# Altium schematic sheet Ext_Mem.SchDoc
size B; Organization: Altium Limited; Address1: L3, 12a Rodborough Rd; Address2: Frenchs Forest; Address3: NSW; Address4: Australia 2086; DocumentNumber: 2; SheetNumber: 2; SheetTotal: 2
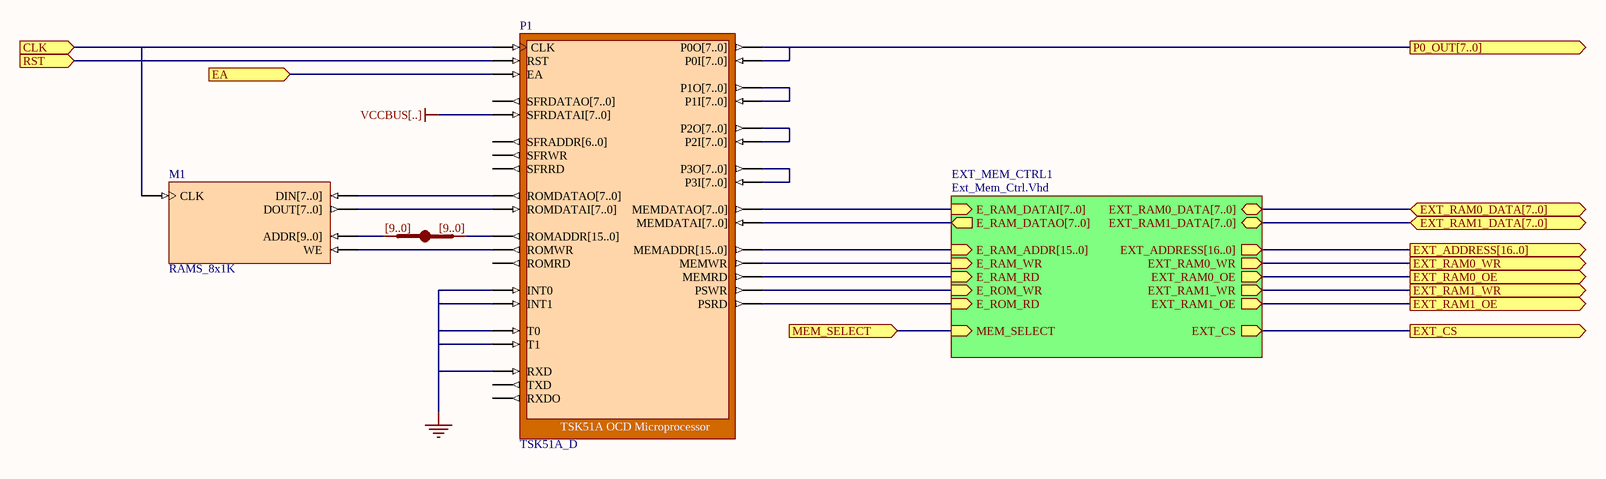
[diagram p0: Ext_Mem.SchDoc]

## Parts
M1  RAMS_8x1K
P1  TSK51A_D
U1  IndexA: [9..0]  (hidden comment: JB)

## Sub-sheets
EXT_MEM_CTRL1 = Ext_Mem_Ctrl.Vhd: EXT_CS (out), E_RAM_ADDR[15..0] (in), E_RAM_DATAI[7..0] (in), E_RAM_DATAO[7..0] (out), E_RAM_RD (in), E_RAM_WR (in), EXT_ADDRESS[16..0] (out), MEM_SELECT (in), EXT_RAM0_DATA[7..0] (bidir), EXT_RAM0_OE (out), EXT_RAM0_WR (out), EXT_RAM1_DATA[7..0] (bidir), EXT_RAM1_OE (out), EXT_RAM1_WR (out), E_ROM_RD (in), E_ROM_WR (in)  | VHDLENTITY: EXT_MEM_CTRL

## Ports
CLK (in), EA (in), EXT_ADDRESS[16..0] (out), EXT_CS (out), EXT_RAM0_DATA[7..0] (bidir), EXT_RAM0_OE (out), EXT_RAM0_WR (out), EXT_RAM1_DATA[7..0] (bidir), EXT_RAM1_OE (out), EXT_RAM1_WR (out), MEM_SELECT (in), P0_OUT[7..0] (out), RST (in)

## Nets
GND: P1.INT0 P1.INT1 P1.RXD P1.T0 P1.T1
VCCBUS[..]: P1.SFRDATAI[7..0]
CLK: M1.CLK P1.CLK ; port CLK
EA: P1.EA ; port EA
EXT_CS: port EXT_CS, sheet EXT_MEM_CTRL1/EXT_CS
EXT_RAM0_OE: port EXT_RAM0_OE, sheet EXT_MEM_CTRL1/EXT_RAM0_OE
EXT_RAM0_WR: port EXT_RAM0_WR, sheet EXT_MEM_CTRL1/EXT_RAM0_WR
EXT_RAM1_OE: port EXT_RAM1_OE, sheet EXT_MEM_CTRL1/EXT_RAM1_OE
EXT_RAM1_WR: port EXT_RAM1_WR, sheet EXT_MEM_CTRL1/EXT_RAM1_WR
MEM_SELECT: port MEM_SELECT, sheet EXT_MEM_CTRL1/MEM_SELECT
P0_OUT[7..0]: P1.P0I[7..0] P1.P0O[7..0] ; port P0_OUT[7..0]
RST: P1.RST ; port RST
NetM1_ADDR[9..0]: M1.ADDR[9..0] U1.B[0..0]
NetM1_DIN[7..0]: M1.DIN[7..0] P1.ROMDATAO[7..0]
NetM1_DOUT[7..0]: M1.DOUT[7..0] P1.ROMDATAI[7..0]
NetM1_WE: M1.WE P1.ROMWR
NetP1_MEMADDR[15..0]: P1.MEMADDR[15..0] ; sheet EXT_MEM_CTRL1/E_RAM_ADDR[15..0]
NetP1_MEMDATAI[7..0]: P1.MEMDATAI[7..0] ; sheet EXT_MEM_CTRL1/E_RAM_DATAO[7..0]
NetP1_MEMDATAO[7..0]: P1.MEMDATAO[7..0] ; sheet EXT_MEM_CTRL1/E_RAM_DATAI[7..0]
NetP1_MEMRD: P1.MEMRD ; sheet EXT_MEM_CTRL1/E_RAM_RD
NetP1_MEMWR: P1.MEMWR ; sheet EXT_MEM_CTRL1/E_RAM_WR
NetP1_P1I[7..0]: P1.P1I[7..0] P1.P1O[7..0]
NetP1_P2I[7..0]: P1.P2I[7..0] P1.P2O[7..0]
NetP1_P3I[7..0]: P1.P3I[7..0] P1.P3O[7..0]
NetP1_PSRD: P1.PSRD ; sheet EXT_MEM_CTRL1/E_ROM_RD
NetP1_PSWR: P1.PSWR ; sheet EXT_MEM_CTRL1/E_ROM_WR
NetP1_ROMADDR[15..0]: P1.ROMADDR[15..0] U1.A[0..0]

Not connected (* = marked no-connect by the designer): P1 ROMRD RXDO SFRADDR[6..0] SFRDATAO[7..0] SFRRD SFRWR TXD

## Buses and harness runs
bus port EXT_ADDRESS[16..0] = sheet EXT_MEM_CTRL1/EXT_ADDRESS[16..0]
bus port EXT_RAM0_DATA[7..0] = sheet EXT_MEM_CTRL1/EXT_RAM0_DATA[7..0]
bus port EXT_RAM1_DATA[7..0] = sheet EXT_MEM_CTRL1/EXT_RAM1_DATA[7..0]

## Notes on the sheet
- Labels drawn without touching a wire or pin: VCCBUS[..]
- Title
- Size:
- Date:
- B
- Number:
- Time:
- Revision:
- Sheet
- of
- File:

## Library data of the parts
M1 = RAMS_8x1K: Single Port Random Access Memory; Memory_Depth: 1024; Memory_Type: RAM_SinglePortBlock; Memory_Width: 8; Memory_ClockEdge: Rising; Nexus_Core: Memory_Program; Published: 13/01/2004; Publisher: Altium Hobart Technology Center
P1 = TSK51A_D: TSK51A OCD Microprocessor; NEXUS_CORE: Processor_OCDS; NEXUS_JTAG_DEVICE: True; NEXUS_JTAG_ORDER: 0; ChildModel1: RAM256x8_TSK51D; ChildCore1: M1; Published: 10/11/2003; Publisher: Altium Hobart Technology Centre; Core Revision: 1.00.00
U1 = JB: System BUS Joiner; ArchiveName: GENERIC; Published: 18-Dec-2003; Publisher: Altium Limited; Core Revision: 1.00.00; IndexB: [9..0]